# EAGLE schematic SKR_1_3_to_GEN_L (EAGLE 7.2.0)
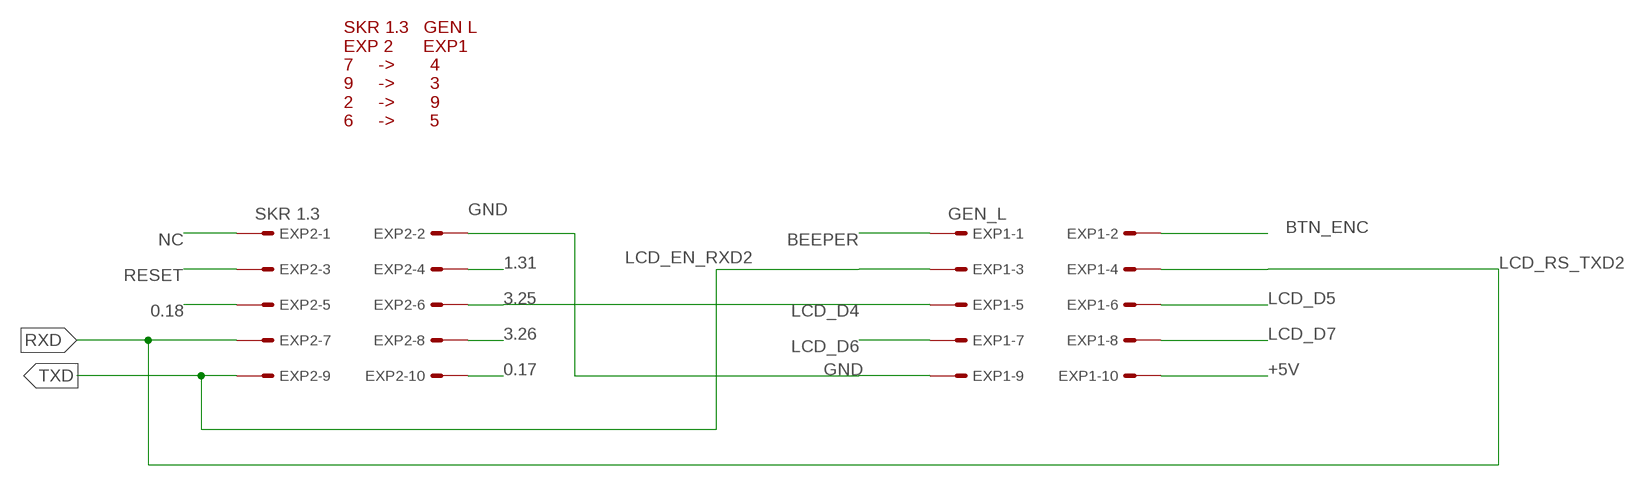
[diagram p0: schematic, sheet 1]

## Parts
EXP1  GEN_L  057-010-1  [057-010-1]
EXP2  SKR 1.3  057-010-1  [057-010-1]

## Nets
0.17: EXP2.10
0.18: EXP2.5
1.31: EXP2.4
3.25: EXP2.6
3.26: EXP2.8
+5V: EXP1.10
BEEPER: EXP1.1
BTN_ENC: EXP1.2
GND: EXP1.9 EXP2.2
LCD_D4: EXP1.5
LCD_D5: EXP1.6
LCD_D6: EXP1.7
LCD_D7: EXP1.8
LCD_EN_RXD2: EXP1.3
LCD_RS_TXD2: EXP1.4
NC: EXP2.1
RESET: EXP2.3
RXD: EXP2.7
TXD: EXP2.9

## Notes on the sheet
- SKR 1.3   GEN L
  EXP 2      EXP1
  7     ->       4
  9     ->       3
  2     ->       9
  6     ->       5

## Library data of the parts
EXP1 EXP2 = con-panduit:057-010-: CONNECTOR 10-pin series 057 contact pc board low profile headers; OC_FARNELL: unknown; OC_NEWARK: unknown